# EAGLE design zcpn (EAGLE 7.1.0)
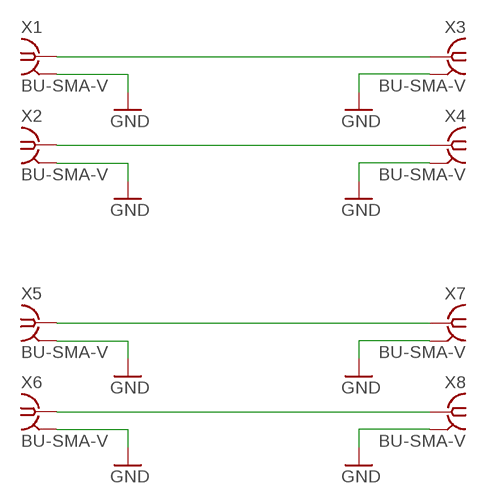
[diagram p0: schematic, sheet 1]

## Parts
X1  BU-SMA-V  [BU-SMA-V]
X2  BU-SMA-V  [BU-SMA-V]
X3  BU-SMA-V  [BU-SMA-V]
X4  BU-SMA-V  [BU-SMA-V]
X5  BU-SMA-V  [BU-SMA-V]
X6  BU-SMA-V  [BU-SMA-V]
X7  BU-SMA-V  [BU-SMA-V]
X8  BU-SMA-V  [BU-SMA-V]

## Nets
GND: X1.2 X1.3 X1.4 X1.5 X2.2 X2.3 X2.4 X2.5 X3.2 X3.3 X3.4 X3.5 X4.2 X4.3 X4.4 X4.5 X5.2 X5.3 X5.4 X5.5 X6.2 X6.3 X6.4 X6.5 X7.2 X7.3 X7.4 X7.5 X8.2 X8.3 X8.4 X8.5
SMA0_N: X2.1 X4.1
SMA0_P: X1.1 X3.1
SMA1_N: X6.1 X8.1
SMA1_P: X5.1 X7.1

## Library data of the parts
X1-X8 = zctl:BU-SMA-V: FEMALE SMA CONNECTOR Radiall distributor RS 112-3794; OC_FARNELL: unknown; OC_NEWARK: unknown

## Net classes
0 GND: clearance 0.61 mm

## Board
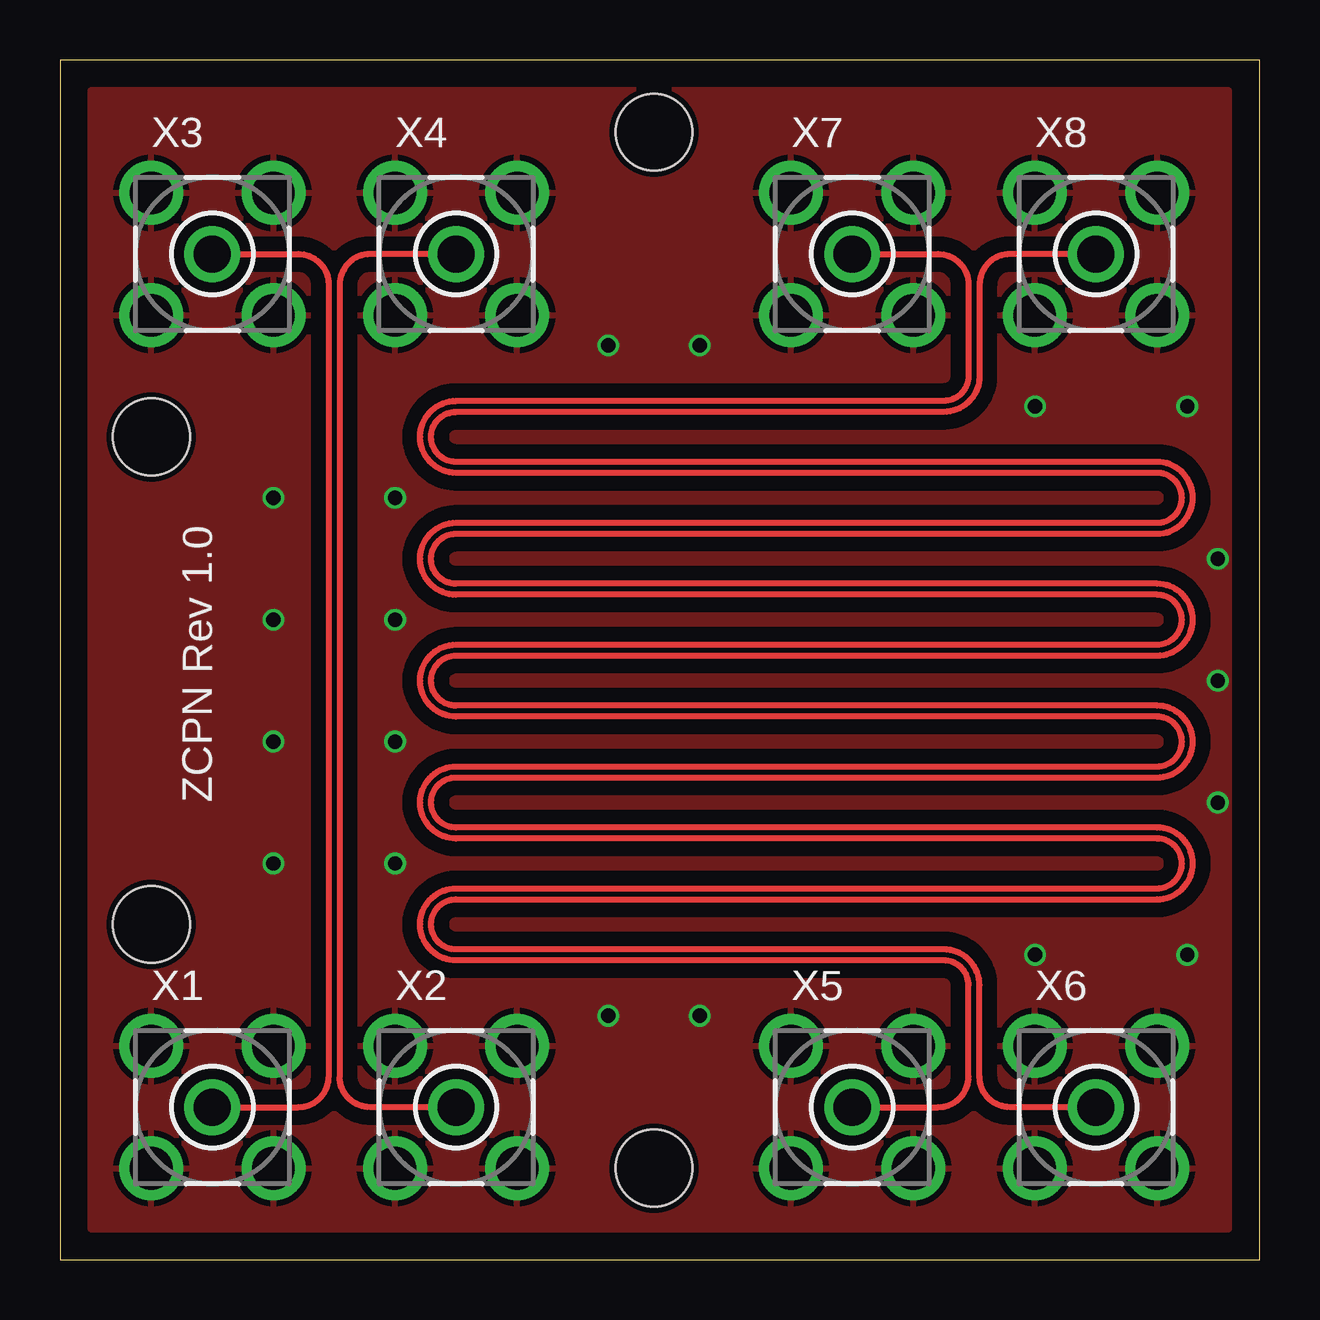
[diagram p1: board, top side]
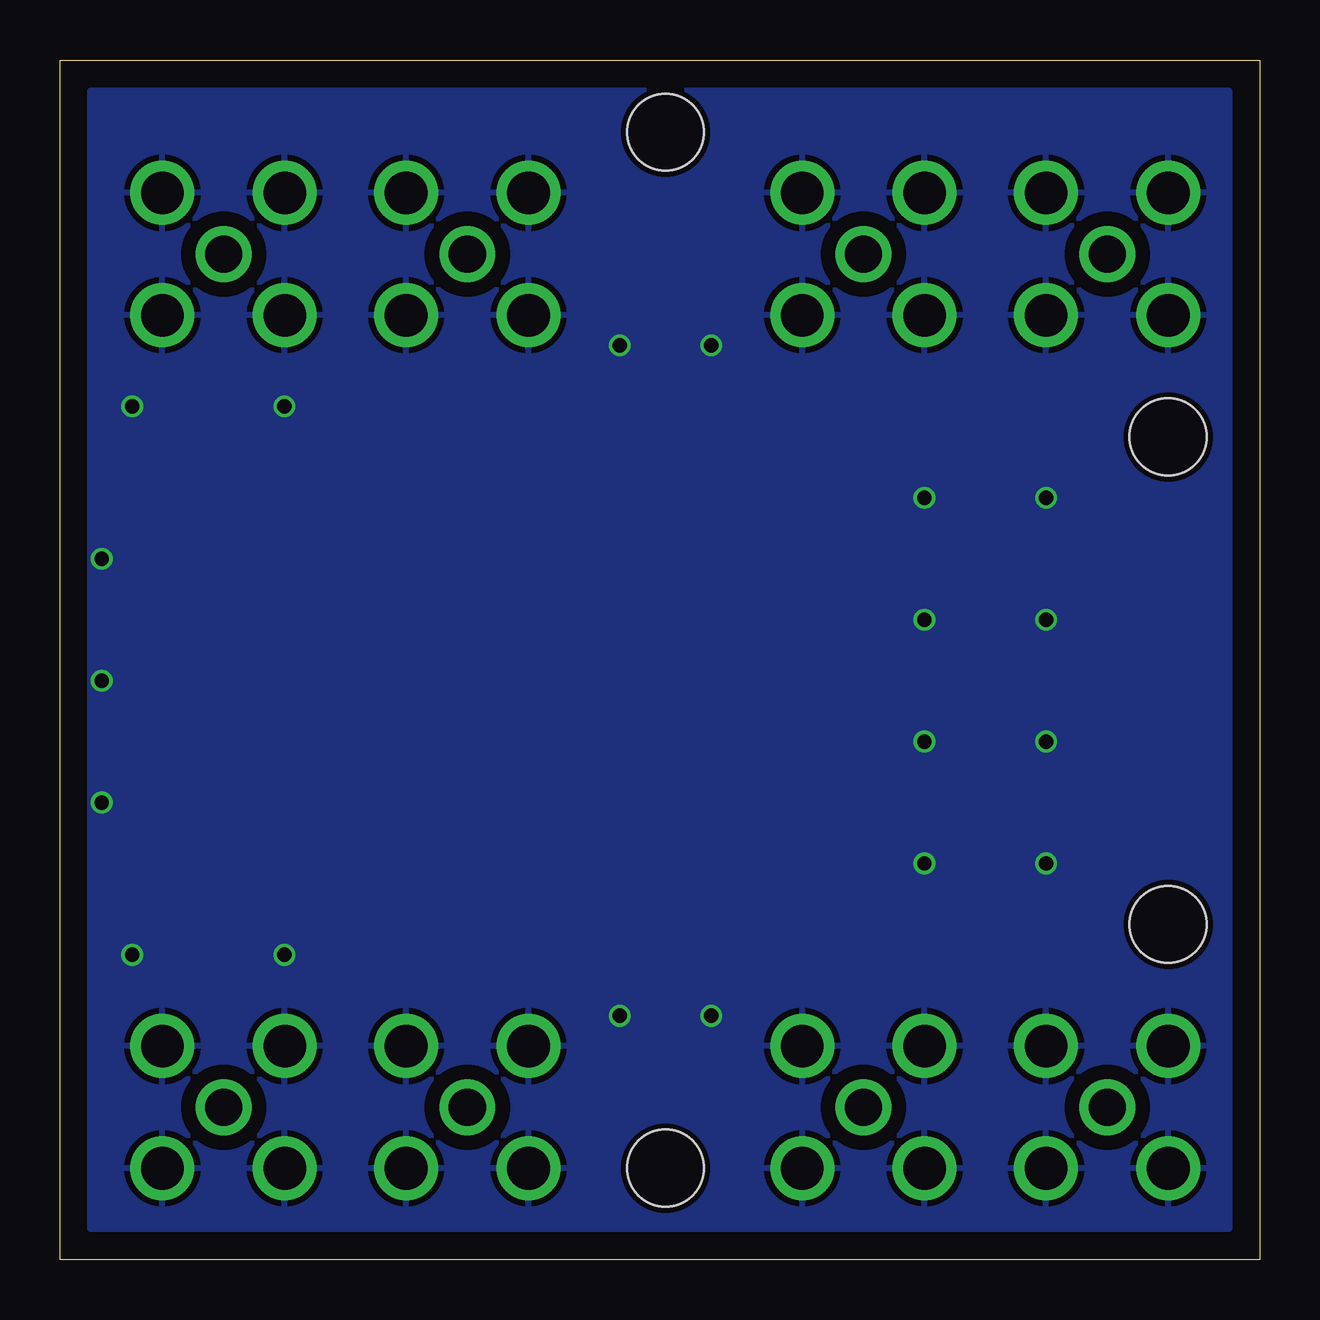
[diagram p2: board, bottom side, seen from below]

Size 50 x 50 mm. Coordinates in mm from the lower left corner, seen from the top.
Outline: 0,0 50,0 50,50 0,50 0,0
Copper layers (1*16): Top 0.035mm / dielectric 0.2mm / Bottom 0.035mm
Design rules "zctl": minimum track width 6mil, minimum drill 12mil, track to track 8mil, track to pad 8mil, pad to pad 8mil, via to via 8mil, smd to smd 0mil, copper to edge 10mil, drill to drill 10mil, minimum pad ring 10mil, minimum via ring 6mil, stop-mask expansion 2mil, vias tented up to drill 100mil, thermal gap 10mil
Holes 3.2 mm at 24.77,46.99 24.77,3.81 3.81,34.29 3.81,13.97

### Footprints (pad centres in the part's own frame; a part is rotated, then mirrored left to right if it is on the bottom)
BU-SMA-V = drill 1.55: 1 0,0 | drill 1.778: 2 -2.55,2.55; 3 2.55,2.55; 4 2.55,-2.55; 5 -2.55,-2.55

### Placement (x,y rotation side)
X1  6.35,6.35 0 top
X2  16.51,6.35 0 top
X3  6.35,41.91 0 top
X4  16.51,41.91 0 top
X5  33.02,6.35 0 top
X6  43.18,6.35 0 top
X7  33.02,41.91 0 top
X8  43.18,41.91 0 top

### Tracks (layer width: path | path; a pad name or v marks a point on that pad's centre or on a via)
GND  (via drill 0.6)
  other vias: 8.89,31.75 13.97,31.75 8.89,26.67 13.97,26.67 8.89,21.59 13.97,16.51 13.97,21.59 8.89,16.51 22.86,38.1 26.67,38.1 40.64,35.56 46.99,35.56 48.26,29.21 48.26,24.13 48.26,19.05 40.64,12.7 46.99,12.7 22.86,10.16 26.67,10.16
  pour Top: 1.27,1.27 48.73,1.27 48.73,48.73 1.27,48.73
  pour Bottom: 1.27,1.27 48.73,1.27 48.73,48.73 1.27,48.73
SMA0_N
  Top 0.254: X2.1 12.93,6.35 arc-90 11.66,7.62 11.66,40.64 arc-90 12.93,41.91 X4.1
SMA0_P
  Top 0.254: X1.1 9.93,6.35 arc90 11.2,7.62 11.2,40.64 arc90 9.93,41.91 X3.1
SMA1_N
  Top 0.254: X6.1 39.6,6.35 arc-90 38.33,7.62 38.33,11.43 arc90 36.83,12.93 16.51,12.93 arc-90 15.47,13.97 arc-90 16.51,15.01 45.72,15.01 arc90 47.22,16.51 arc90 45.72,18.01 16.51,18.01 arc-90 15.47,19.05 arc-90 16.51,20.09 45.72,20.09 arc90 47.22,21.59 arc90 45.72,23.09 16.51,23.09 arc-90 15.47,24.13 arc-90 16.51,25.17 45.72,25.17 arc90 47.22,26.67 arc90 45.72,28.17 16.51,28.17 arc-90 15.47,29.21 arc-90 16.51,30.25 45.72,30.25 arc90 47.22,31.75 arc90 45.72,33.25 16.51,33.25 arc-90 15.47,34.29 arc-90 16.51,35.33 36.83,35.33 arc90 38.33,36.83 38.33,40.64 arc-90 39.6,41.91 X8.1
SMA1_P
  Top 0.254: X5.1 36.6,6.35 arc90 37.87,7.62 37.87,11.43 arc90 36.83,12.47 16.51,12.47 arc-90 15.01,13.97 arc-90 16.51,15.47 45.72,15.47 arc90 46.76,16.51 arc90 45.72,17.55 16.51,17.55 arc-90 15.01,19.05 arc-90 16.51,20.55 45.72,20.55 arc90 46.76,21.59 arc90 45.72,22.63 16.51,22.63 arc-90 15.01,24.13 arc-90 16.51,25.63 45.72,25.63 arc90 46.76,26.67 arc90 45.72,27.71 16.51,27.71 arc-90 15.01,29.21 arc-90 16.51,30.71 45.72,30.71 arc90 46.76,31.75 arc90 45.72,32.79 16.51,32.79 arc-90 15.01,34.29 arc-90 16.51,35.79 36.83,35.79 arc90 37.87,36.83 37.87,40.64 arc90 36.6,41.91 X7.1

### Text on the board
tPlace: ZCPN Rev 1.0